# Altium schematic sheet Sheet2.SchDoc
size A4; SheetNumber: 1; SheetTotal: 1
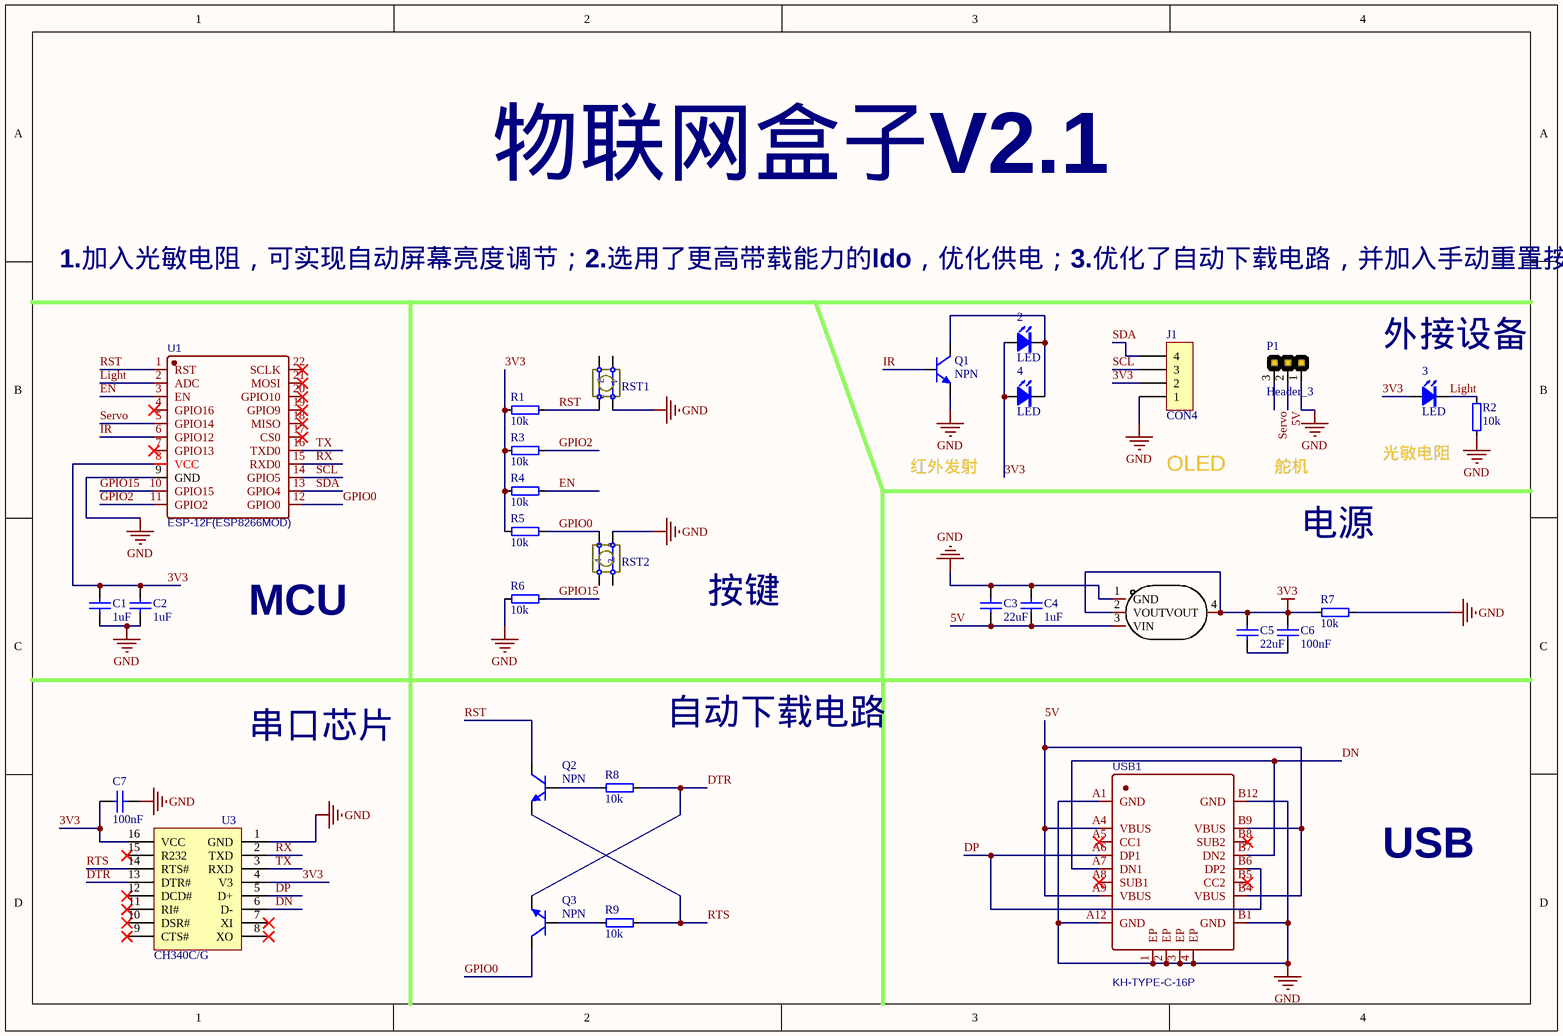
[diagram p0: Sheet2.SchDoc]

## Parts
2  LED  [D1]
3  LED  [D1]
4  LED  [D1]
C1  1uF  [0603S]
C2  1uF  [0603S]
C3  22uF  [0603S]
C4  1uF  [0603S]
C5  22uF  [0603S]
C6  100nF  [0603S]
C7  100nF  [0603S]
J1  CON4  [HDR1X4]
P1  Header_3  [Header_3]
Q1  NPN  [SOT-23]
Q2  NPN  [SOT-23]
Q3  NPN  [SOT-23]
R1  10k  [0603S]
R2  10k  [0603S]
R3  10k  [0603S]
R4  10k  [0603S]
R5  10k  [0603S]
R6  10k  [0603S]
R7  10k  [0603S]
R8  10k  [0603S]
R9  10k  [0603S]
RST1  SW-PB  [SW-SMD_TSA365G00-250]  (value not drawn)
RST2  SW-PB  [SW-SMD_TSA365G00-250]  (value not drawn)
U1  ESP-12F(ESP8266MOD)  [WIFIM-SMD_ESP-12F-ESP8266MOD]
U2  AMS1117-3.3  [SOT-223-3_L6.7-W3.7-P2.30-LS7.0-BR]  (value not drawn)
U3  CH340C/G  [SOP16]
USB1  KH-TYPE-C-16P  [USB-C-SMD_KH-TYPE-C-16P]

## Nets
3V3: 2.1(A) 3.1(A) 4.1(A) C1.1 C2.1 C5.1 C6.1 C7.2 J1.2 R1.1 R3.1 R4.1 R5.1 R7.1 U1.8(VCC) U2.2(VOUT) U2.4(VOUT) U3.4(V3) U3.16(VCC)
GND: C1.2 C2.2 C3.1 C4.1 C7.1 J1.1 P1.1 Q1.1(E) R2.1 R6.1 R7.2 RST1.1 RST2.2 U1.9(GND) U2.1(GND) U3.1(GND) USB1.1(EP) USB1.2(EP) USB1.3(EP) USB1.4(EP) USB1.A1(GND) USB1.A12(GND) USB1.B1(GND) USB1.B12(GND)
5V: C3.2 C4.2 P1.2 U2.3(VIN) USB1.A4(VBUS) USB1.A9(VBUS) USB1.B4(VBUS) USB1.B9(VBUS)
DN: U3.6(D-) USB1.A7(DN1) USB1.B7(DN2)
DP: U3.5(D+) USB1.A6(DP1) USB1.B6(DP2)
DTR: Q3.1(E) R8.2 U3.13(DTR#)
EN: R4.2 U1.3(EN)
GPIO0: Q3.3(C) R5.2 RST2.1 U1.12(GPIO0)
GPIO2: R3.2 U1.11(GPIO2)
GPIO15: R6.2 U1.10(GPIO15)
IR: Q1.2(B) U1.6(GPIO12)
Light: 3.2(K) R2.2 U1.2(ADC)
RST: Q2.3(C) R1.2 RST1.2 U1.1(RST)
RTS: Q2.1(E) R9.2 U3.14(RTS#)
RX: U1.15(RXD0) U3.2(TXD)
SCL: J1.3 U1.14(GPIO5)
SDA: J1.4 U1.13(GPIO4)
Servo: P1.3 U1.5(GPIO14)
TX: U1.16(TXD0) U3.3(RXD)
Net2_2: 2.2(K) 4.2(K) Q1.3(C)
NetC5_2: C5.2 C6.2
NetQ2_2: Q2.2(B) R8.1
NetQ3_2: Q3.2(B) R9.1

Not connected (* = marked no-connect by the designer): RST1 3 4; RST2 3 4; U1 4(GPIO16)* 7(GPIO13)* 17(CS0)* 18(MISO)* 19(GPIO9)* 20(GPIO10)* 21(MOSI)* 22(SCLK)*; U3 7(XI)* 8(XO)* 9(CTS#)* 10(DSR#)* 11(RI#)* 12(DCD#)* 15(R232)*; USB1 A5(CC1)* A8(SUB1)* B5(CC2)* B8(SUB2)*

## Notes on the sheet
- 物联网盒子V2.1
- 1.加入光敏电阻，可实现自动屏幕亮度调节；2.选用了更高带载能力的ldo，优化供电；3.优化了自动下载电路，并加入手动重置按钮
- 外接设备
- 红外发射
- OLED
- 舵机
- 光敏电阻
- 电源
- MCU
- 按键
- 串口芯片
- 自动下载电路
- USB

## Library data of the parts
C1-C7 = 电容0805
J1 = CON4: Connector
P1 = Header_3: 插针; Comm: 插针3
Q1-Q3 = NPN: triode
R1-R9 = RES
RST1 RST2 = SW-PB: 微动开关，轻触按键
U1 = ESP-12F(ESP8266MOD): BOM_Manufacturer: Ai-Thinker; BOM_Supplier: LCSC; BOM_Manufacturer Part: ESP-12F(ESP8266MOD); BOM_Supplier Part: C82891; BOM_JLCPCB Part Class: Extended Part; spicePre: U; spiceSymbolName: ESP-12F(ESP8266MOD)
U2 = AMS1117-3.3: Manufacturer: JSMSEMI(杰盛微); Symbol: AMS1117-3.3_C917183; Add into BOM: yes; Name: AMS1117-3.3; Device: AMS1117-3.3; LCSC Part Name: AMS1117-3.3; Supplier Part: C917183; Manufacturer Part: AMS1117-3.3; Supplier Footprint: SOT-223; JLCPCB Part Class: Extended Part; Datasheet: https://atta.szlcsc.com/upload/public/pdf/source/20211201/578FEEF9766904D398893791CE3EC879.pdf; Supplier: LCSC; Convert to PCB: yes; Output Type: -
U3 = CH340G: USB转COM口
USB1 = KH-TYPE-C-16P: BOM_Manufacturer: Shenzhen Kinghelm Elec; Contributor: LCSC; BOM_Supplier: LCSC; BOM_Supplier Part: C709357; BOM_Manufacturer Part: KH-TYPE-C-16P; BOM_JLCPCB Part Class: Extended Part; spicePre: U; spiceSymbolName: KH-TYPE-C-16P